# Altium schematic sheet TI_92_kbd_ND.SchDoc: Keyboard
size C; Organization: Altium Limited; Address1: L3, 12a Rodborough Rd; Address2: Frenchs Forest; Address3: NSW; Address4: Australia 2086; SheetNumber: 4
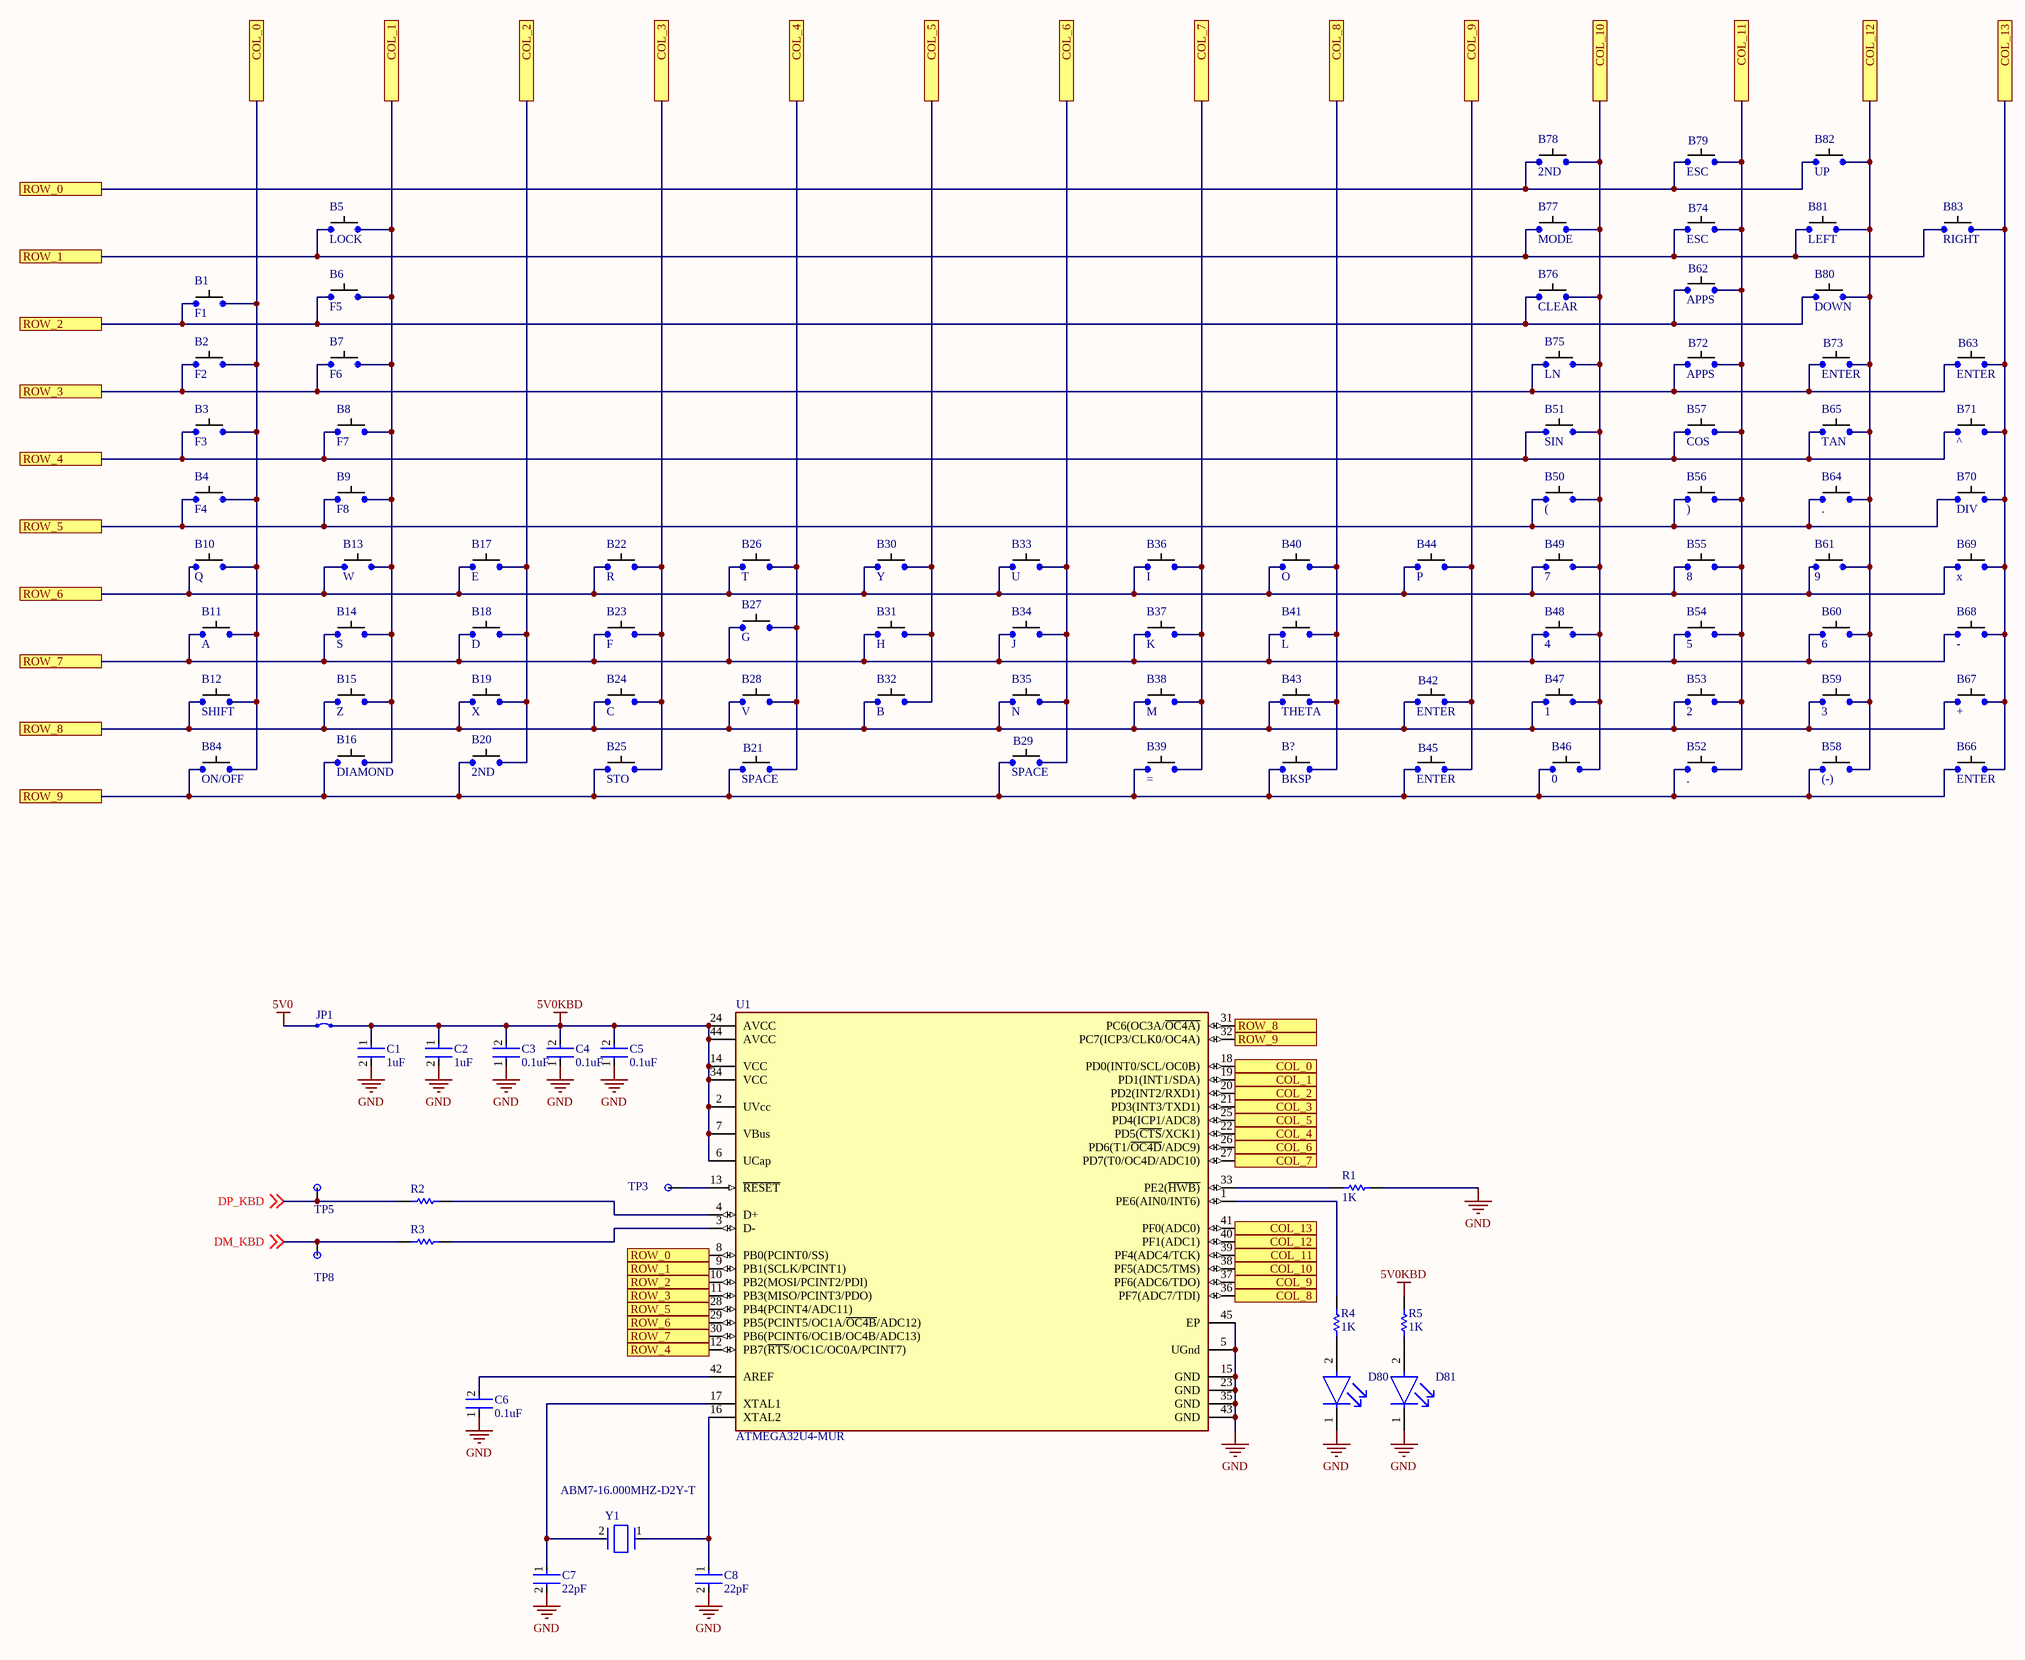
[diagram p0: TI_92_kbd_ND.SchDoc]

## Parts
B1  F1  [6mm_button_contacts]
B2  F2  [6mm_button_contacts]
B3  F3  [6mm_button_contacts]
B4  F4  [6mm_button_contacts]
B5  LOCK  [6mm_button_contacts]
B6  F5  [6mm_button_contacts]
B7  F6  [6mm_button_contacts]
B8  F7  [6mm_button_contacts]
B9  F8  [6mm_button_contacts]
B10  Q  [6mm_button_contacts]
B11  A  [6mm_button_contacts]
B12  SHIFT  [6mm_button_contacts]
B13  W  [6mm_button_contacts]
B14  S  [6mm_button_contacts]
B15  Z  [6mm_button_contacts]
B16  DIAMOND  [6mm_button_contacts]
B17  E  [6mm_button_contacts]
B18  D  [6mm_button_contacts]
B19  X  [6mm_button_contacts]
B20  2ND  [6mm_button_contacts]
B21  SPACE  [6mm_button_contacts]
B22  R  [6mm_button_contacts]
B23  F  [6mm_button_contacts]
B24  C  [6mm_button_contacts]
B25  STO  [6mm_button_contacts]
B26  T  [6mm_button_contacts]
B27  G  [6mm_button_contacts]
B28  V  [6mm_button_contacts]
B29  SPACE  [6mm_button_contacts]
B30  Y  [6mm_button_contacts]
B31  H  [6mm_button_contacts]
B32  B  [6mm_button_contacts]
B33  U  [6mm_button_contacts]
B34  J  [6mm_button_contacts]
B35  N  [6mm_button_contacts]
B36  I  [6mm_button_contacts]
B37  K  [6mm_button_contacts]
B38  M  [6mm_button_contacts]
B39  (no value)  [6mm_button_contacts]
B40  O  [6mm_button_contacts]
B41  L  [6mm_button_contacts]
B42  ENTER  [6mm_button_contacts]
B43  THETA  [6mm_button_contacts]
B44  P  [6mm_button_contacts]
B45  ENTER  [6mm_button_contacts]
B46  0  [6mm_button_contacts]
B47  1  [6mm_button_contacts]
B48  4  [6mm_button_contacts]
B49  7  [6mm_button_contacts]
B50  (  [6mm_button_contacts]
B51  SIN  [6mm_button_contacts]
B52  .  [6mm_button_contacts]
B53  2  [6mm_button_contacts]
B54  5  [6mm_button_contacts]
B55  8  [6mm_button_contacts]
B56  )  [6mm_button_contacts]
B57  COS  [6mm_button_contacts]
B58  (-)  [6mm_button_contacts]
B59  3  [6mm_button_contacts]
B60  6  [6mm_button_contacts]
B61  9  [6mm_button_contacts]
B62  APPS  [6mm_button_contacts]
B63  ENTER  [6mm_button_contacts]
B64  .  [6mm_button_contacts]
B65  TAN  [6mm_button_contacts]
B66  ENTER  [6mm_button_contacts]
B67  +  [6mm_button_contacts]
B68  -  [6mm_button_contacts]
B69  x  [6mm_button_contacts]
B70  DIV  [6mm_button_contacts]
B71  ^  [6mm_button_contacts]
B72  APPS  [6mm_button_contacts]
B73  ENTER  [6mm_button_contacts]
B74  ESC  [6mm_button_contacts]
B75  LN  [6mm_button_contacts]
B76  CLEAR  [6mm_button_contacts]
B77  MODE  [6mm_button_contacts]
B78  2ND  [6mm_button_contacts]
B79  ESC  [6mm_button_contacts]
B80  DOWN  [D_PAD_BUTTON]
B81  LEFT  [D_PAD_BUTTON]
B82  UP  [D_PAD_BUTTON]
B83  RIGHT  [D_PAD_BUTTON]
B84  ON/OFF  [6mm_button_contacts]
B?  BKSP  [6mm_button_contacts]
C1  1uF  [FP-C0402C105K8PACTU-MFG]
C2  1uF  [FP-C0402C105K8PACTU-MFG]
C3  0.1uF  [FP-GRM15-MFG]
C4  0.1uF  [FP-GRM15-MFG]
C5  0.1uF  [FP-GRM15-MFG]
C6  0.1uF  [FP-GRM15-MFG]
C7  22pF  [FP-C0402C105K8PACTU-MFG]
C8  22pF  [FP-C0402C105K8PACTU-MFG]
D80  APHHS1005CGCK  [FP-APHHS1005CGCK-MFG]  (value not drawn)
D81  APHHS1005CGCK  [FP-APHHS1005CGCK-MFG]  (value not drawn)
JP1  Solder Jumper  [SOLDER_JUMPER_CLOSED]  (value not drawn)
R1  1K  [RESC1005X40X25LL05T05]
R2  CRCW040222R0FKED  [RESC1005X40X25LL05T05]  (value not drawn)
R3  CRCW040222R0FKED  [RESC1005X40X25LL05T05]  (value not drawn)
R4  1K  [RESC1005X40X25NL05T10]
R5  1K  [RESC1005X40X25NL05T10]
TP3  Test Pad  [1.5MM_PAD]  (value not drawn)
TP5  Test Pad  [1.5MM_PAD]  (value not drawn)
TP8  Test Pad  [1.5MM_PAD]  (value not drawn)
U1  ATMEGA32U4-MUR  [FP-44PW-MFG]
Y1  ABM7-16.000MHZ-D2Y-T  [FP-ABM7-MFG]

## Ports
COL_0, COL_1, COL_2, COL_3, COL_4, COL_5, COL_6, COL_7, COL_8, COL_9, COL_10, COL_11, COL_12, COL_13, ROW_0, ROW_1, ROW_2, ROW_3, ROW_4, ROW_5, ROW_6, ROW_7, ROW_8, ROW_9

## Nets
5V0: JP1.1
5V0KBD: C1.1 C2.1 C3.2 C4.2 C5.2 JP1.2 R5.2 U1.2(UVcc) U1.6(UCap) U1.7(VBus) U1.14(VCC) U1.24(AVCC) U1.34(VCC) U1.44(AVCC)
GND: C1.2 C2.2 C3.1 C4.1 C5.1 C6.1 C7.2 C8.2 D80.1(C) D81.1(C) R1.2 U1.5(UGnd) U1.15(GND) U1.23(GND) U1.35(GND) U1.43(GND) U1.45(EP)
COL_0: B1.1 B2.1 B3.1 B4.1 B10.1 B11.1 B12.1 B84.1 U1.18(PD0(INT0/SCL/OC0B)) ; port COL_0
COL_1: B5.1 B6.1 B7.1 B8.1 B9.1 B13.1 B14.1 B15.1 B16.1 U1.19(PD1(INT1/SDA)) ; port COL_1
COL_2: B17.1 B18.1 B19.1 B20.1 U1.20(PD2(INT2/RXD1)) ; port COL_2
COL_3: B22.1 B23.1 B24.1 B25.1 U1.21(PD3(INT3/TXD1)) ; port COL_3
COL_4: B21.1 B26.1 B27.1 B28.1 U1.22(PD5(~{CTS}/XCK1)) ; port COL_4
COL_5: B30.1 B31.1 B32.1 U1.25(PD4(ICP1/ADC8)) ; port COL_5
COL_6: B29.1 B33.1 B34.1 B35.1 U1.26(PD6(T1/~{OC4D}/ADC9)) ; port COL_6
COL_7: B36.1 B37.1 B38.1 B39.1 U1.27(PD7(T0/OC4D/ADC10)) ; port COL_7
COL_8: B40.1 B41.1 B43.1 B?.1 U1.36(PF7(ADC7/TDI)) ; port COL_8
COL_9: B42.1 B44.1 B45.1 U1.37(PF6(ADC6/TDO)) ; port COL_9
COL_10: B46.1 B47.1 B48.1 B49.1 B50.1 B51.1 B75.1 B76.1 B77.1 B78.1 U1.38(PF5(ADC5/TMS)) ; port COL_10
COL_11: B52.1 B53.1 B54.1 B55.1 B56.1 B57.1 B62.1 B72.1 B74.1 B79.1 U1.39(PF4(ADC4/TCK)) ; port COL_11
COL_12: B58.1 B59.1 B60.1 B61.1 B64.1 B65.1 B73.1 B80.1 B81.1 B82.1 U1.40(PF1(ADC1)) ; port COL_12
COL_13: B63.1 B66.1 B67.1 B68.1 B69.1 B70.1 B71.1 B83.1 U1.41(PF0(ADC0)) ; port COL_13
DM_KBD: R3.1 TP8.1(PAD) ; off-sheet DM_KBD
DP_KBD: R2.1 TP5.1(PAD) ; off-sheet DP_KBD
ROW_0: B78.2 B79.2 B82.2 U1.8(PB0(PCINT0/SS)) ; port ROW_0
ROW_1: B5.2 B74.2 B77.2 B81.2 B83.2 U1.9(PB1(SCLK/PCINT1)) ; port ROW_1
ROW_2: B1.2 B6.2 B62.2 B76.2 B80.2 U1.10(PB2(MOSI/PCINT2/PDI)) ; port ROW_2
ROW_3: B2.2 B7.2 B63.2 B72.2 B73.2 B75.2 U1.11(PB3(MISO/PCINT3/PDO)) ; port ROW_3
ROW_4: B3.2 B8.2 B51.2 B57.2 B65.2 B71.2 U1.12(PB7(~{RTS}/OC1C/OC0A/PCINT7)) ; port ROW_4
ROW_5: B4.2 B9.2 B50.2 B56.2 B64.2 B70.2 U1.28(PB4(PCINT4/ADC11)) ; port ROW_5
ROW_6: B10.2 B13.2 B17.2 B22.2 B26.2 B30.2 B33.2 B36.2 B40.2 B44.2 B49.2 B55.2 B61.2 B69.2 U1.29(PB5(PCINT5/OC1A/~{OC4B}/ADC12)) ; port ROW_6
ROW_7: B11.2 B14.2 B18.2 B23.2 B27.2 B31.2 B34.2 B37.2 B41.2 B48.2 B54.2 B60.2 B68.2 U1.30(PB6(PCINT6/OC1B/OC4B/ADC13)) ; port ROW_7
ROW_8: B12.2 B15.2 B19.2 B24.2 B28.2 B32.2 B35.2 B38.2 B42.2 B43.2 B47.2 B53.2 B59.2 B67.2 U1.31(PC6(OC3A/~{OC4A)}) ; port ROW_8
ROW_9: B16.2 B20.2 B21.2 B25.2 B29.2 B39.2 B45.2 B46.2 B52.2 B58.2 B66.2 B84.2 B?.2 U1.32(PC7(ICP3/CLK0/OC4A)) ; port ROW_9
NetC6_2: C6.2 U1.42(AREF)
NetC7_1: C7.1 U1.17(XTAL1) Y1.2
NetC8_1: C8.1 U1.16(XTAL2) Y1.1
NetD80_2: D80.2(A) R4.1
NetD81_2: D81.2(A) R5.1
NetR1_1: R1.1 U1.33(PE2(~{HWB)})
NetR2_2: R2.2 U1.4(D+)
NetR3_2: R3.2 U1.3(D-)
NetR4_2: R4.2 U1.1(PE6(AIN0/INT6))
NetTP3_1: TP3.1(PAD) U1.13(~{RESET})

## Notes on the sheet
- Title
- Size:
- Date:
- File:
- C
- Number:
- Time:
- Revision:
- Sheet
- of

## Library data of the parts
B1-B84 B? = BUTTON: Contact pads to match TI-92 PCB patterns for carbon contact button
C1 C2 C7 C8 = CMP-2008-02081-2: CAP CER 1UF 10V X5R 0402; Dielectric Material: Ceramic; Dissipation Factor: 5%; Tolerance: 10%; Number of Pins: 2; Contact Plating: Tin; Min Operating Temperature: -55°C; Termination: SMD/SMT; Lead Free: Lead Free; Construction: Flat; Voltage Rating (DC): 10V; Mount: Surface Mount; Series: C; Thickness: 0.022inch; Width: 0.5mm; Radiation Hardening: No; Capacitance: 1uF; Dielectric: X5R; Height: 0.5mm; Voltage: 10V; Length: 1mm; Depth: 0.5mm; Max Operating Temperature: 85°C; Package Quantity: 1; Packaging: Tape and Reel; RoHS Compliant: Yes; Case Code (Imperial): 0402; Case Code (Metric): 1005; REACH SVHC: No SVHC; Voltage Rating: 10V; Case/Package: 0402
C3-C6 = CMP-2100-03641-2: CAP CER 0.1UF 16V X7R 0402; Manufacturer Part Number: GRM155R71C104KA88D; Manufacturer: Murata; Standoff Height: 0mm; Tolerance: 10%; Voltage Rating: 16Vdc; Material: Ceramic; Capacitance: 0.10μF; Value: 0.10μF; RoHS: TRUE; Temperature Characteristic: X7R; Octopart: https://octopart.com/grm155r71c104ka88d-murata-196880; Digikey Description: CAP CER 0.1UF 16V X7R 0402; Device Class L3: Ceramic Capacitors; Height: 0.55mm; ComponentLink2Description: Datasheet; Temperature Range Low: -55°C; Ipc Land Pattern Name: CAPC10050X219; ComponentLink2URL: https://search.murata.co.jp/Ceramy/image/img/A01X/G101/ENG/GRM155R71H471KA01-01A.pdf; Device Class L1: Passive Components; Lead Free: yes; Category: Cap; Package: GRM15; Temperature: -55°C to +125°C; Device Class L2: Capacitors; Temperature Range High: +125°C; Mouser Description: 0402 0.1 uF 16V ±10 % Tolerance X7R SMT Multilayer Ceramic Capacitor
D80 D81 = CMP-44529-000044-1: LED GREEN CLEAR CHIP SMD; Viewing Angle: 120°; Dominant Wavelength: 570nm; Test Current: 20mA; Luminous Intensity: 50mcd; Forward Voltage: 2.1V; Number of LEDs: 1; Lens Color: Clear; Packaging: Tape and Reel; Max Operating Temperature: 85°C; Illumination Color: Green; Length: 1mm; Mount: Surface Mount; Lens Style: Clear; Color: Green; Number of Pins: 2; Wavelength: 570nm; Case/Package: 0402; Width: 0.5mm; Package Quantity: 2000; Case Code (Metric): 1005; Height: 0.6mm; Lead Free: Lead Free; Case Code (Imperial): 0402; Forward Current: 20mA; Min Operating Temperature: -40°C
JP1 = Solder_Jumper: Solder Jumpers, open and closed
R1 = CMP-2002-08382-1: Manufacturer: Vishay Dale; Part Number: CRCW040222R0FKED
R2 R3 = CMP-2002-08382-1: Manufacturer: Vishay Dale; Part Number: CRCW040222R0FKED
R4 R5 = CMP-2002-07472-1: Part Number: RC0402FR-071KL; Manufacturer: Yageo / Phycomp
TP3 TP5 TP8 = Test_Pad: Various Test Pads
U1 = CMP-06276-000039-1: IC MCU 8BIT 32KB FLASH 44VQFN; Oscillator Type: Internal; Interface: I2C; Core Architecture: PIC; Number of I/Os: 21; Peripherals: Brown-out Detect/Reset; Packaging: Rail/Tube; Memory Size: 32KB; Memory Type: FLASH; Case/Package: SOIC; Max Operating Temperature: 125°C; Min Operating Temperature: -40°C
Y1 = CMP-27762-000095-1: Crystal 16MHz ±20ppm 18pF SMD-2 6mm x 3.5mm; ESR (Equivalent Series Resistance): 50R; Frequency Stability: 30ppm; Width: 3.3mm; Frequency: 16MHz; Radiation Hardening: No; Height: 0.055inch; Tolerance: 20ppm; Length: 6mm; Case/Package: CSMD; Lead Free: Lead Free; Min Operating Temperature: -40°C; Termination: SMD/SMT; Operating Frequency: 16 MHz; Resistor Type: Ceramic; Packaging: Tape and Reel; Mount: Surface Mount; Load Capacitance: 18pF; Frequency Tolerance: 20ppm; Depth: 3.5mm; Series: ABM7; Package Quantity: 1000; Max Operating Temperature: 85°C; Number of Pins: 2